# EAGLE design Stackduino-SMD (EAGLE 7.2.0)
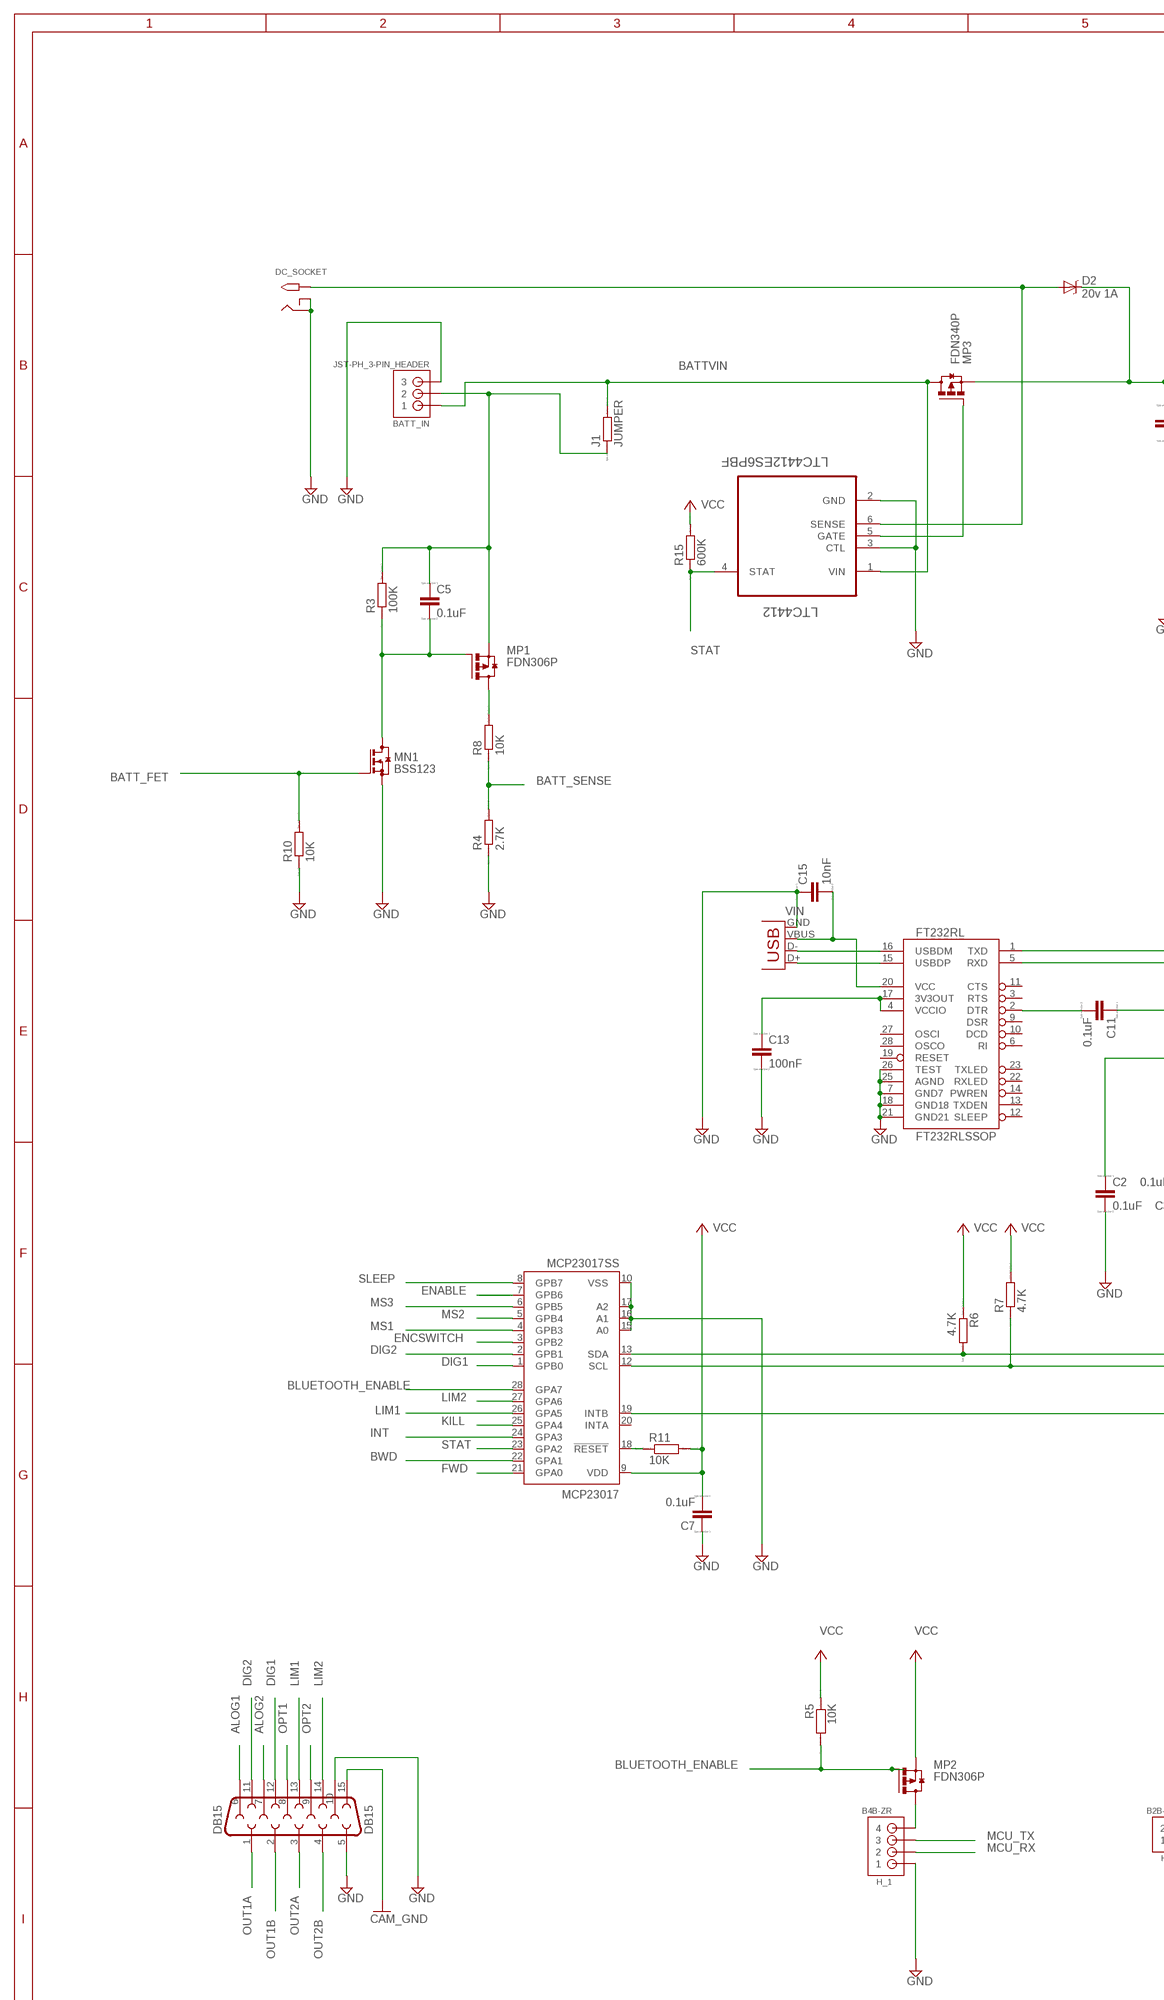
[diagram p0: schematic, sheet 1, part 1 of 2]
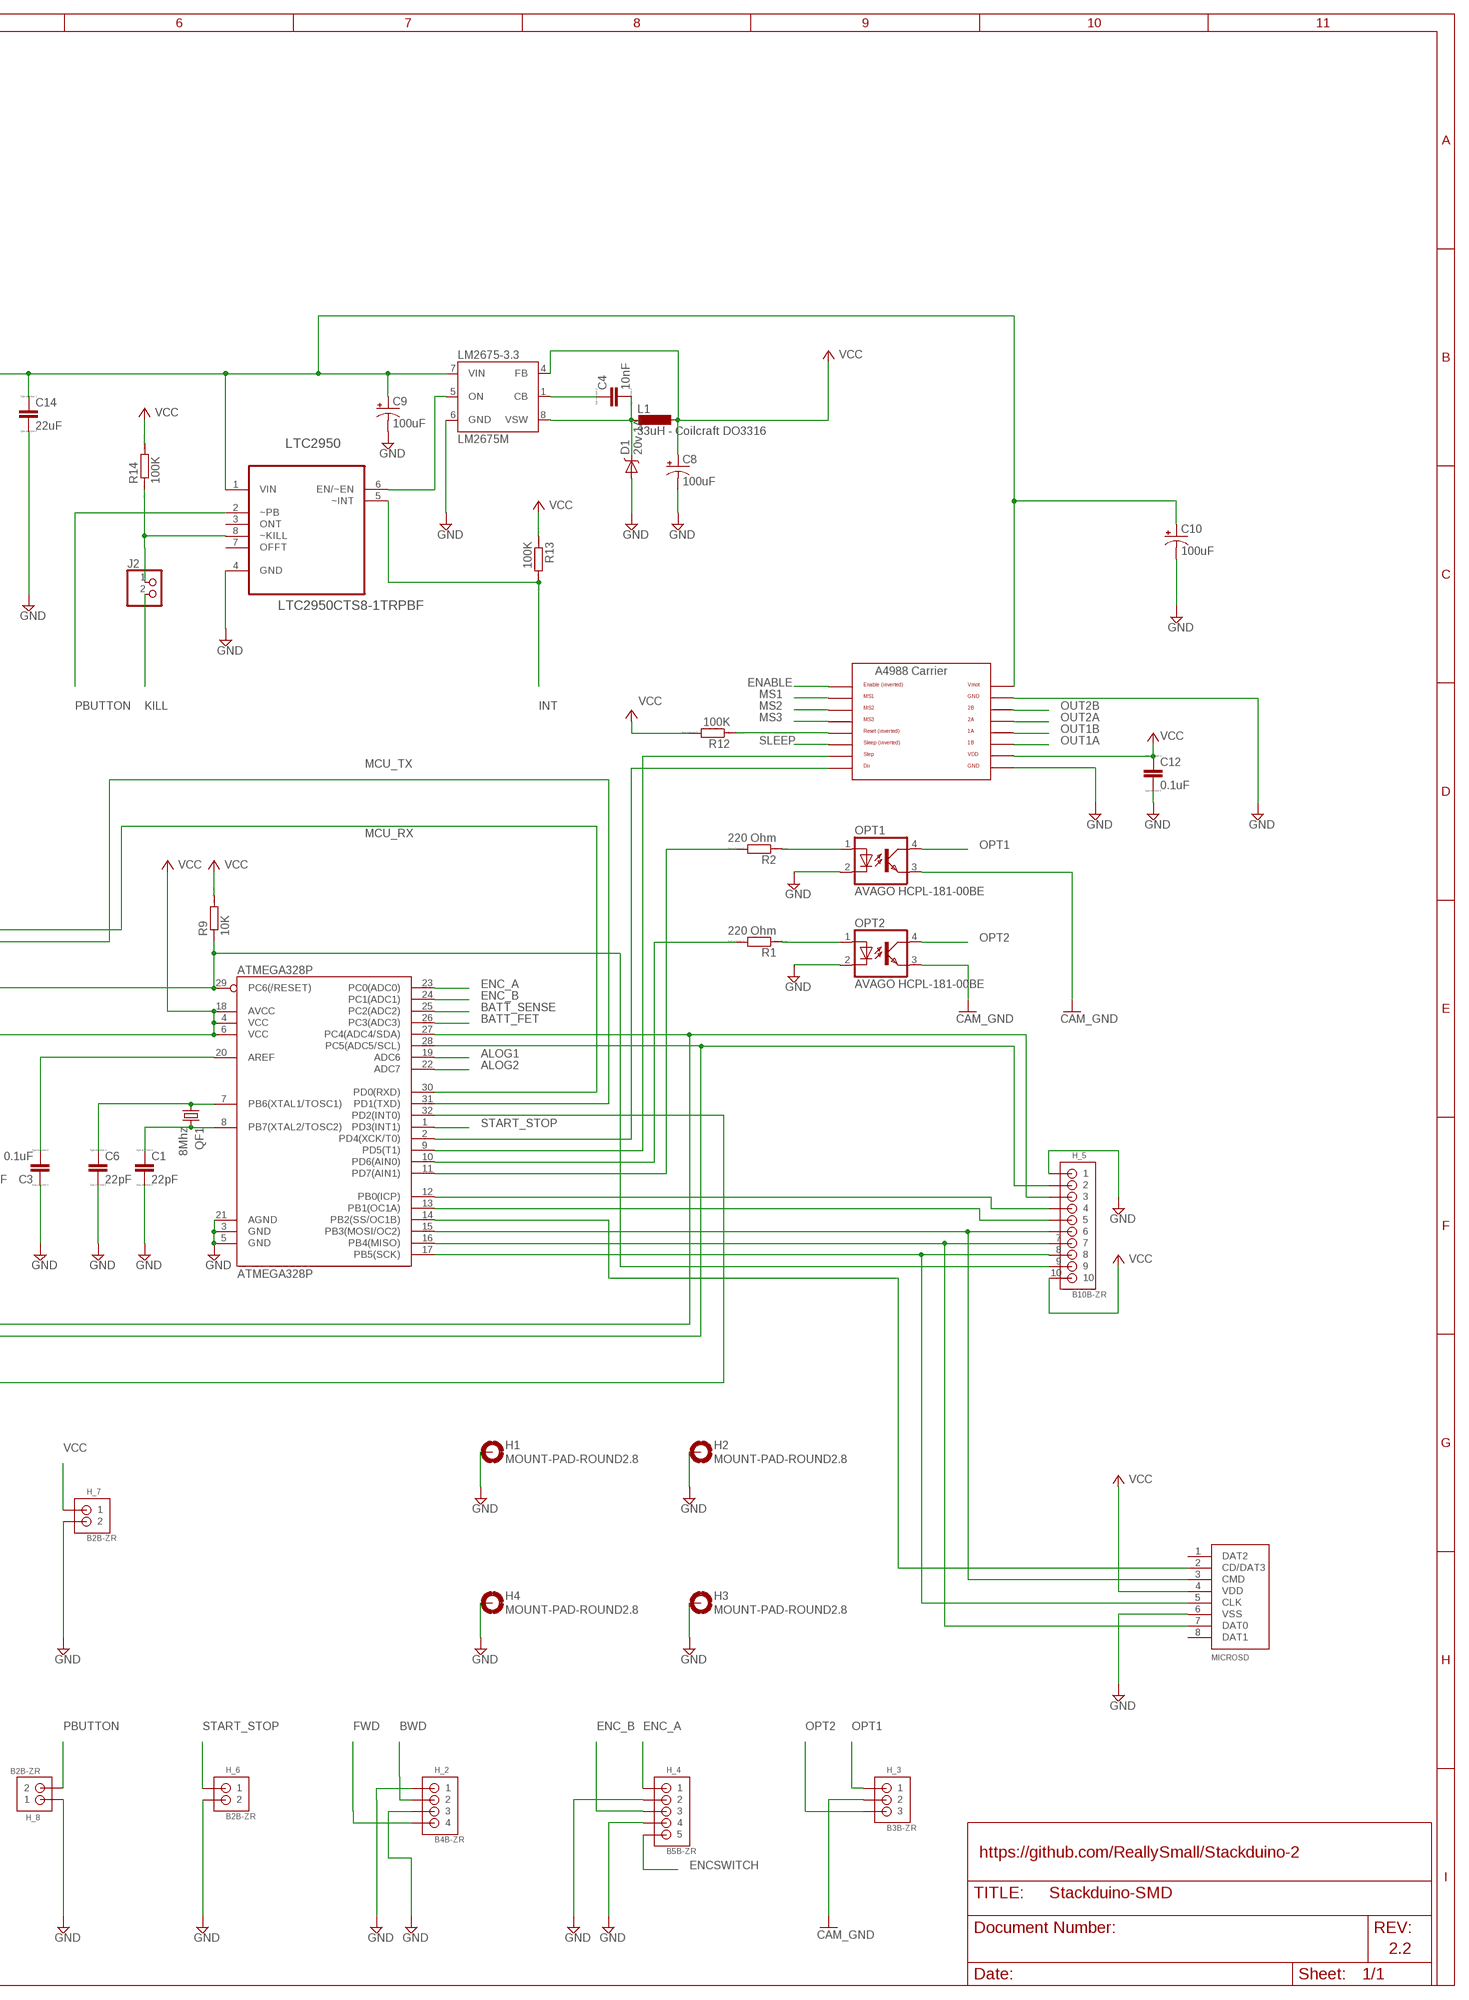
[diagram p1: schematic, sheet 1, part 2 of 2]

## Parts
A4988_CARRIER  A4988BREAKOUT  [A4988BREAKOUT]
ATMEGA328P  ATMEGA328P  ATMEGA328_SMT  [TQFP32-08]
BATT_IN  JST-PH_3-PIN_HEADER  [JST_B3B-PH_HEADER]
C1  22pF  C  [C0805]
C2  0.1uF  C  [C0805]
C3  0.1uF  C  [C0805]
C4  10nF  C  [C0805]
C5  0.1uF  C  [C0805]
C6  22pF  C  [C0805]
C7  0.1uF  C  [C0805]
C8  100uF  CAP_POLD  [PANASONIC_D]
C9  100uF  CAP_POLD  [PANASONIC_D]
C10  100uF  CAP_POLD  [PANASONIC_D]
C11  0.1uF  C  [C0805]
C12  0.1uF  C  [C0805]
C13  100nF  C  [C0805]
C14  22uF  C  [C0805]
C15  10nF  C  [C0805]
D1  20v 1A  MBRA140  [SMA-DIODE]
D2  20v 1A  MBRA140  [SMA-DIODE]
DB15  DB15  [DB15]
DC_SOCKET  2.1MMJACKTHM  [PJ-102A]
FT232RL  FT232RLSSOP  [SSOP28DB]
H1  MOUNT-PAD-ROUND2.8  [2,8-PAD]
H2  MOUNT-PAD-ROUND2.8  [2,8-PAD]
H3  MOUNT-PAD-ROUND2.8  [2,8-PAD]
H4  MOUNT-PAD-ROUND2.8  [2,8-PAD]
H_1  B4B-ZR  [B4B-ZR]
H_2  B4B-ZR  [B4B-ZR]
H_3  B3B-ZR  [B3B-ZR]
H_4  B5B-ZR  [B5B-ZR]
H_5  B10B-ZR  [B10B-ZR]
H_6  B2B-ZR  [B2B-ZR]
H_7  B2B-ZR  [B2B-ZR]
H_8  B2B-ZR  [B2B-ZR]
J1  JUMPER  R  [R0805]
J2  PINHD-1X2  [1X02]
L1  33uH - Coilcraft DO3316  DO3316P  [DO3316P]
LM2675-3.3  LM2675M  [SO08]
LTC2950  LTC2950CTS8-1TRPBF  [SOT65P280X100-8N]
LTC4412  LTC4412ES6PBF  [SOT95P280X100-6N]
MCP23017  MCP23017SS  [SSOP28]
MICROSD  CON_MICROSDHINGED  [CON_MICROSD_HINGED]
MN1  BSS123  [SOT23]
MP1  FDN306P  FDN360P  [SUPER-SOT3]
MP2  FDN306P  FDN360P  [SUPER-SOT3]
MP3  FDN340P  FDN360P  [SUPER-SOT3]
OPT1  AVAGO HCPL-181-00BE  LTV816S  [SMD4]
OPT2  AVAGO HCPL-181-00BE  LTV816S  [SMD4]
QF1  8Mhz  CRYSTALHC49U-V  [HC49U-V]
R1  220 Ohm  R  [R0805]
R2  220 Ohm  R  [R0805]
R3  100K  R  [R0805]
R4  2.7K  R  [R0805]
R5  10K  R  [R0805]
R6  4.7K  R  [R0805]
R7  4.7K  R  [R0805]
R8  10K  R  [R0805]
R9  10K  R  [R0805]
R10  10K  R  [R0805]
R11  10K  R  [R0805]
R12  100K  R  [R0805]
R13  100K  R  [R0805]
R14  100K  R  [R0805]
R15  600K  R  [R0805]
USB  USBSMD  [USB-MINIB]

## Nets
3V3_SET: C13.1 FT232RL.4(VCCIO) FT232RL.17(3V3OUT)
A4988_RESET: A4988_CARRIER.RST R12.1
ALOG1: ATMEGA328P.19(ADC6) DB15.6
ALOG2: ATMEGA328P.22(ADC7) DB15.7
BATT_FET: ATMEGA328P.26(PC3(ADC3)) MN1.1(G) R10.2
BATT_SENSE: ATMEGA328P.25(PC2(ADC2)) R4.2 R8.1
BATT_SENSE_UPSTREAM: MP1.3(D) R8.2
BATT_VOLT: BATT_IN.P2 C5.1 J1.1 MP1.2(S) R3.2
BATT_VOLT_ENABLE: C5.2 MN1.3(D) MP1.1(G) R3.1
BATTVIN: BATT_IN.P1 J1.2 LTC4412.1(VIN) MP3.3(D)
BLUETOOTH_ENABLE: MCP23017.28(GPA7) MP2.1(G) R5.2
BWD: H_2.2 MCP23017.22(GPA1)
CAM_GND: DB15.15 H_3.2 OPT1.3(EMIT) OPT2.3(EMIT)
DIG1: DB15.12 MCP23017.1(GPB0)
DIG2: DB15.11 MCP23017.2(GPB1)
DIR: A4988_CARRIER.DIR ATMEGA328P.2(PD4(XCK/T0))
ENABLE: A4988_CARRIER.EN MCP23017.7(GPB6)
ENC_A: ATMEGA328P.23(PC0(ADC0)) H_4.1
ENC_B: ATMEGA328P.24(PC1(ADC1)) H_4.3
ENCSWITCH: H_4.5 MCP23017.3(GPB2)
FWD: H_2.4 MCP23017.21(GPA0)
GATE: LTC4412.5(GATE) MP3.1(G)
GND: A4988_CARRIER.GND A4988_CARRIER.GND@0(GND) ATMEGA328P.3(GND) ATMEGA328P.5(GND) ATMEGA328P.21(AGND) BATT_IN.P3 C1.2 C2.2 C3.1 C6.2 C7.1 C8.- C9.- C10.- C12.2 C13.2 C14.2 C15.1 D1.A DB15.5 DB15.10 DC_SOCKET.RING DC_SOCKET.RING_SW FT232RL.7(GND7) FT232RL.18(GND18) FT232RL.21(GND21) FT232RL.25(AGND) FT232RL.26(TEST) H1.B2,8(MOUNT) H2.B2,8(MOUNT) H3.B2,8(MOUNT) H4.B2,8(MOUNT) H_1.1 H_2.1 H_2.3 H_4.2 H_4.4 H_5.1 H_6.2 H_7.2 H_8.1 LM2675-3.3.6(GND) LTC2950.4(GND) LTC4412.2(GND) LTC4412.3(CTL) MCP23017.10(VSS) MCP23017.15(A0) MCP23017.16(A1) MCP23017.17(A2) MICROSD.6(VSS) MN1.2(S) OPT1.2(C) OPT2.2(C) R4.1 R10.1 USB.GND
I2C_SCL: ATMEGA328P.28(PC5(ADC5/SCL)) H_5.2 MCP23017.12(SCL) R7.1
I2C_SDA: ATMEGA328P.27(PC4(ADC4/SDA)) H_5.3 MCP23017.13(SDA) R6.2
INT: LTC2950.5(~INT) MCP23017.24(GPA3) R13.2
KILL: J2.2 MCP23017.25(GPA4)
KILL_2: J2.1 LTC2950.8(~KILL) R14.1
LIM1: DB15.13 MCP23017.26(GPA5)
LIM2: DB15.14 MCP23017.27(GPA6)
LM2675_CB: C4.1 LM2675-3.3.1(CB)
LM2675_ENABLE: LM2675-3.3.5(ON) LTC2950.6(EN/~EN)
LM2675_OUT: C4.2 D1.C L1.1 LM2675-3.3.8(VSW)
MCP_INT: ATMEGA328P.32(PD2(INT0)) MCP23017.19(INTB)
MCP_RESET: MCP23017.18(!RESET) R11.1
MCU_RX: ATMEGA328P.30(PD0(RXD)) FT232RL.1(TXD) H_1.2
MCU_TX: ATMEGA328P.31(PD1(TXD)) FT232RL.5(RXD) H_1.3
MISO: ATMEGA328P.16(PB4(MISO)) H_5.7 MICROSD.7(DAT0)
MOSI: ATMEGA328P.15(PB3(MOSI/OC2)) H_5.6 MICROSD.3(CMD)
MS1: A4988_CARRIER.MS1 MCP23017.4(GPB3)
MS2: A4988_CARRIER.MS2 MCP23017.5(GPB4)
MS3: A4988_CARRIER.MS3 MCP23017.6(GPB5)
N$3: C11.2 FT232RL.2(DTR)
N$5: FT232RL.16(USBDM) USB.D-
N$6: FT232RL.15(USBDP) USB.D+
N$11: ATMEGA328P.20(AREF) C3.2
N$13: H_1.4 MP2.3(D)
N$30: C15.2 FT232RL.20(VCC) USB.VBUS
OPT1: DB15.8 H_3.1 OPT1.4(COL)
OPT1_IN: OPT1.1(A) R2.1
OPT1_MCU: ATMEGA328P.11(PD7(AIN1)) R2.2
OPT2: DB15.9 H_3.3 OPT2.4(COL)
OPT2_IN: OPT2.1(A) R1.1
OPT2_MCU: ATMEGA328P.10(PD6(AIN0)) R1.2
OUT1A: A4988_CARRIER.1B DB15.1
OUT1B: A4988_CARRIER.1A DB15.2
OUT2A: A4988_CARRIER.2A DB15.3
OUT2B: A4988_CARRIER.2B DB15.4
PBUTTON: H_8.2 LTC2950.2(~PB)
RESET: ATMEGA328P.29(PC6(/RESET)) C11.1 H_5.9 R9.1
SCK: ATMEGA328P.17(PB5(SCK)) H_5.8 MICROSD.5(CLK)
SLEEP: A4988_CARRIER.SLP(SLEEP) MCP23017.8(GPB7)
SS_1: ATMEGA328P.14(PB2(SS/OC1B)) MICROSD.2(CD/DAT3)
SS_2: ATMEGA328P.13(PB1(OC1A)) H_5.5
SS_3: ATMEGA328P.12(PB0(ICP)) H_5.4
START_STOP: ATMEGA328P.1(PD3(INT1)) H_6.1
STAT: LTC4412.4(STAT) MCP23017.23(GPA2) R15.1
STEP: A4988_CARRIER.STEP ATMEGA328P.9(PD5(T1))
V+: A4988_CARRIER.VMOT C9.+ C10.+ C14.1 D2.C LM2675-3.3.7(VIN) LTC2950.1(VIN) MP3.2(S)
VCC: A4988_CARRIER.VDD ATMEGA328P.4(VCC) ATMEGA328P.6(VCC) ATMEGA328P.18(AVCC) C2.1 C7.2 C8.+ C12.1 H_5.10 H_7.1 L1.2 LM2675-3.3.4(FB) MCP23017.9(VDD) MICROSD.4(VDD) MP2.2(S) R5.1 R6.1 R7.2 R9.2 R11.2 R12.2 R13.1 R14.2 R15.2
VIN: D2.A DC_SOCKET.TIP LTC4412.6(SENSE)
XTAL1: ATMEGA328P.7(PB6(XTAL1/TOSC1)) C6.1 QF1.1
XTAL2: ATMEGA328P.8(PB7(XTAL2/TOSC2)) C1.1 QF1.2
Unconnected: FT232RL.3(RTS) FT232RL.6(RI) FT232RL.9(DSR) FT232RL.10(DCD) FT232RL.11(CTS) FT232RL.12(SLEEP) FT232RL.13(TXDEN) FT232RL.14(PWREN) FT232RL.19(RESET) FT232RL.22(RXLED) FT232RL.23(TXLED) FT232RL.27(OSCI) FT232RL.28(OSCO) LTC2950.3(ONT) LTC2950.7(OFFT) MCP23017.20(INTA) MICROSD.1(DAT2) MICROSD.8(DAT1)

## Notes on the sheet
- https://github.com/ReallySmall/Stackduino-2
- 2.2

## Library data of the parts
A4988_CARRIER = RepRapjr:A4988BREAKOUT
ATMEGA328P = SparkFun-DigitalIC:ATMEGA328_SMT: 32-Pin Atmega328 part Commonly used on Arduino compatible boards Available in QFP and QFN packages TQFP is IC-09069 QFN is non-stock; PROD_ID: IC-09069
BATT_IN = SRG:JST-PH_3-PIN_HEADER: 3-pin JST PH Shrouded Header, top entry P/N B3B-PH-K-S Mating connector PHR-3
C1-C7 C11-C15 = eagle-ltspice:C: CAPACITOR, European symbol; SPICEMODEL: NONE; SPICEPREFIX: C
C8-C10 = SparkFun-Passives:CAP_POL: Capacitor Polarized These are standard SMD and PTH capacitors. Normally 10uF, 47uF, and 100uF in electrolytic and tantalum varieties. Always verify the external diameter of the through hole cap, it varies with capacity, voltage, and manufacturer. The EIA devices should be standard.
D1 D2 = SparkFun-DiscreteSemi:MBRA140: 40V, 1A Schottky rectifier SMA/DO-214AC package DIO-08053; PROD_ID: DIO-08053
DB15 = SparkFun-Connectors:DB15: DB15 / VGA right angle through-hole female connector.
DC_SOCKET = adafruit:2.1MMJACK: 2.1mm x 5.5mm THM DC jack with internal switch. Digikey part #PJ-102A, 4UCON part #05537 2.1mm x 5.5mm SMT DC jack with internal switch. Digikey part #PJ-002A-SMT, 4UCON part #03267 By microbuilder.eu & adafruit.com
FT232RL = SparkFun-DigitalIC:FT232RL: USB UART FT232RL 4th Generation USB UART (USB <-> Serial) Controller. Spark Fun Electronics SKU : COM-00650 Production SKU IC-00870; PROD_ID: IC-00870
H1-H4 = holes:MOUNT-PAD-ROUND: MOUNTING PAD, round
H_1 H_2 = jst-connectors:B4B-ZR: JST-ZH Connector 4 pol, 1.5mm pitch Package: B4B-ZR Source: http://www.jst-mfg.com/product/pdf/eng/eZH.pdf
H_3 = jst-connectors:B3B-ZR: JST-ZH Connector 3 pol, 1.5mm pitch Package: B3B-ZR Source: http://www.jst-mfg.com/product/pdf/eng/eZH.pdf
H_4 = jst-connectors:B5B-ZR: JST-ZH Connector 5 pol, 1.5mm pitch Package: B5B-ZR Source: http://www.jst-mfg.com/product/pdf/eng/eZH.pdf
H_5 = jst-connectors:B10B-ZR: JST-ZH Connector 9 pol, 1.5mm pitch Package: B9B-ZR
H_6-H_8 = jst-connectors:B2B-ZR: JST-ZH Connector 2 pol, 1.5mm pitch Package: B2B-ZR
J1 R1-R15 = eagle-ltspice:R: RESISTOR, European symbol; SPICEMODEL: NONE; SPICEPREFIX: R
J2 = pinhead:PINHD-1X2: PIN HEADER
L1 = inductor-coilcraft:DO3316P: COILCRAFT; OC_FARNELL: unknown; OC_NEWARK: unknown
LM2675-3.3 = v-reg-3:LM2675: National Semiconductor <http://www.national.com> 1.0A "Simple Switcher"(c) 260kHz, Vout 1.2-37V, Vin 40V, 250mOhm DMOS switch, 50µA standby current
LTC2950 = LTC_By_element14_Batch_1:LTC2950CTS8-1TRPBF: Push Button On/Off Controller; MPN: LTC2950CTS8-1#TRPBF; OC_FARNELL: 1537418; OC_NEWARK: 56M7180; PACKAGE: TSOT-23-8; SUPPLIER: Linear Technology
LTC4412 = LTC_By_element14_Batch_1:LTC4412ES6PBF: Low Loss PowerPath Controller; MPN: LTC4412ES6#PBF; OC_FARNELL: 1531480; OC_NEWARK: 61M3335; PACKAGE: TSOT-23-6; SUPPLIER: Linear Technology
MCP23017 = adafruit:MCP23017: http://ww1.microchip.com/downloads/en/DeviceDoc/21952a.pdf Source: http://ww1.microchip.com/downloads/en/DeviceDoc/21952a.pdf
MICROSD = dp_devices:CON_MICROSD
MN1 = transistor-small-signal:BSS123: N-CHANNEL MOS FET
MP1-MP3 = transistor-power:FDN360P: Single P-Channel, PowerTrench (R) MOSFET Source: http://www.fairchildsemi.com/ds/FD/FDN360P.pdf
OPT1 OPT2 = optocoupler:LTV816: OPTO COUPLER Source: LITEON, LTV816.pdf; OC_FARNELL: unknown; OC_NEWARK: unknown
QF1 = crystal:CRYSTAL: CRYSTAL; OC_FARNELL: 1666969; OC_NEWARK: unknown
USB = SparkFun-Connectors:USB: USB Connectors USB-B-PTH is fully proven SKU : PRT-00139/CONN-08278 USB-miniB is fully proven SKU : PRT-00587 USB-A-PCB is untested. USB-A-H is throughly reviewed, but untested. Spark Fun Electronics SKU : PRT-00437 USB-B-SMT is throughly reviewed, but untested. Needs silkscreen touching up. USB-A-S has not been used/tested USB-MB-H has not been used/tested USB-MICROB has been used. CONN-09505

## Board
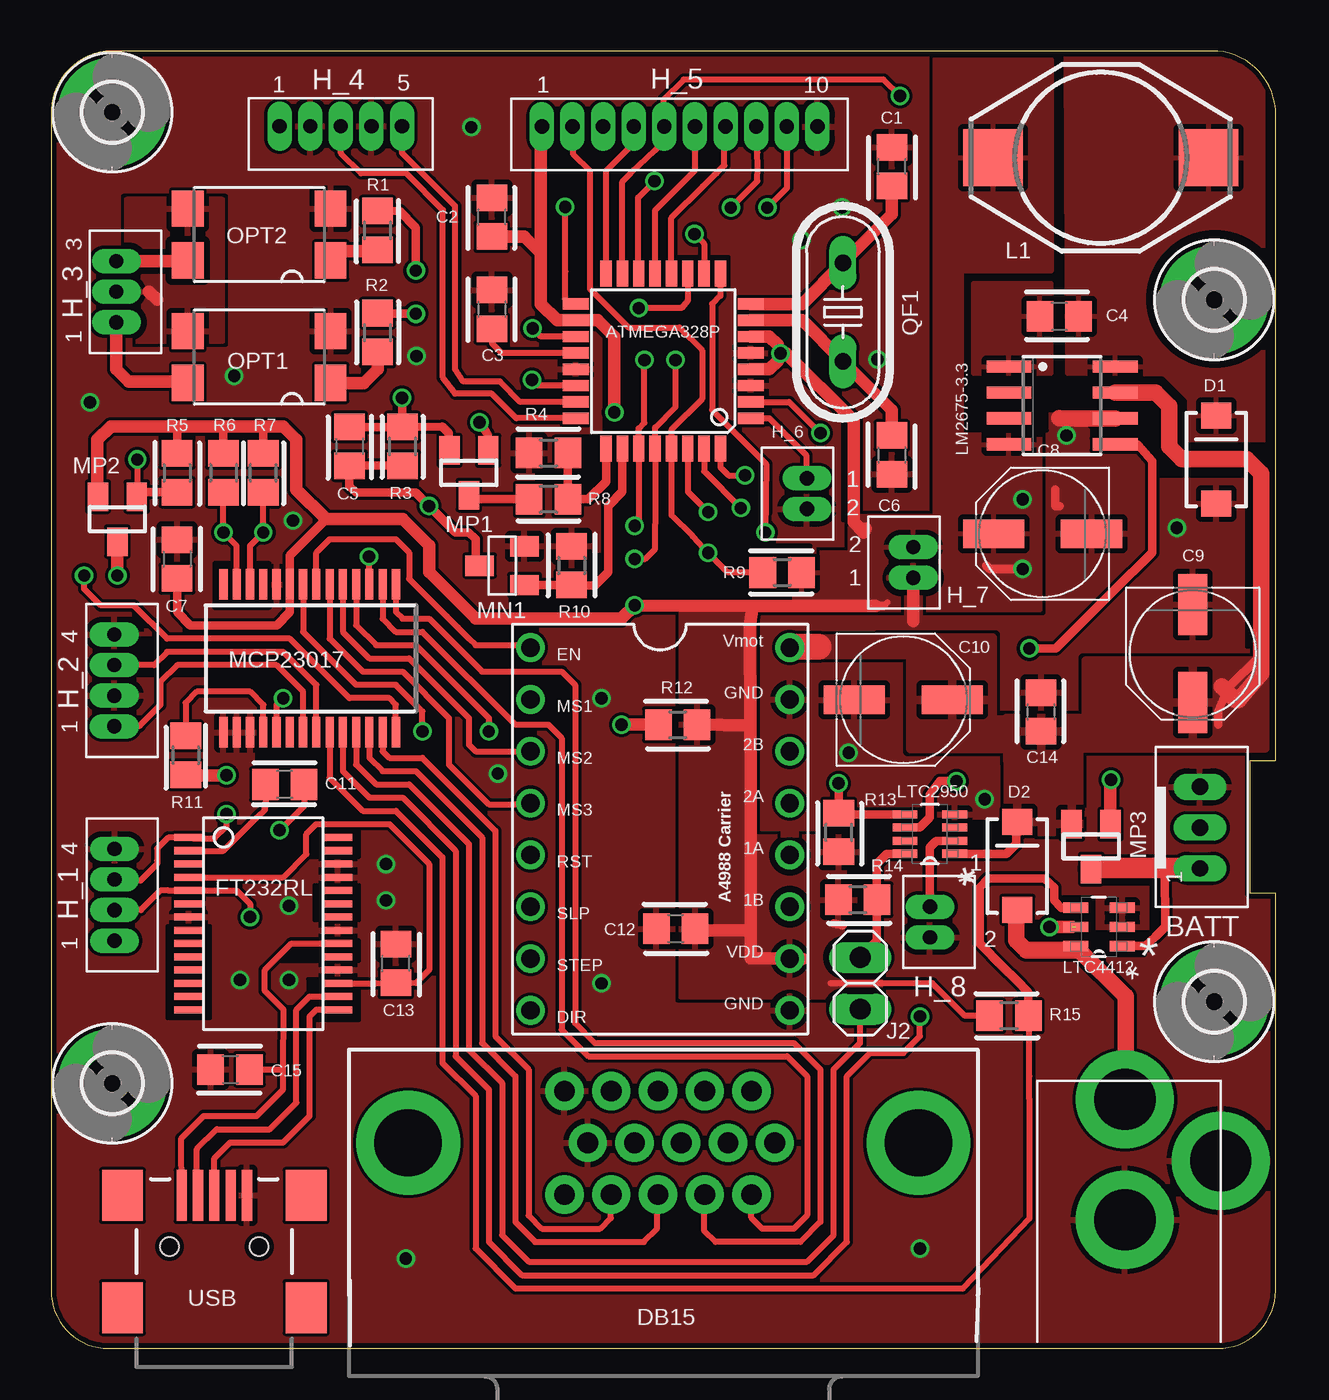
[diagram p2: board, top side]
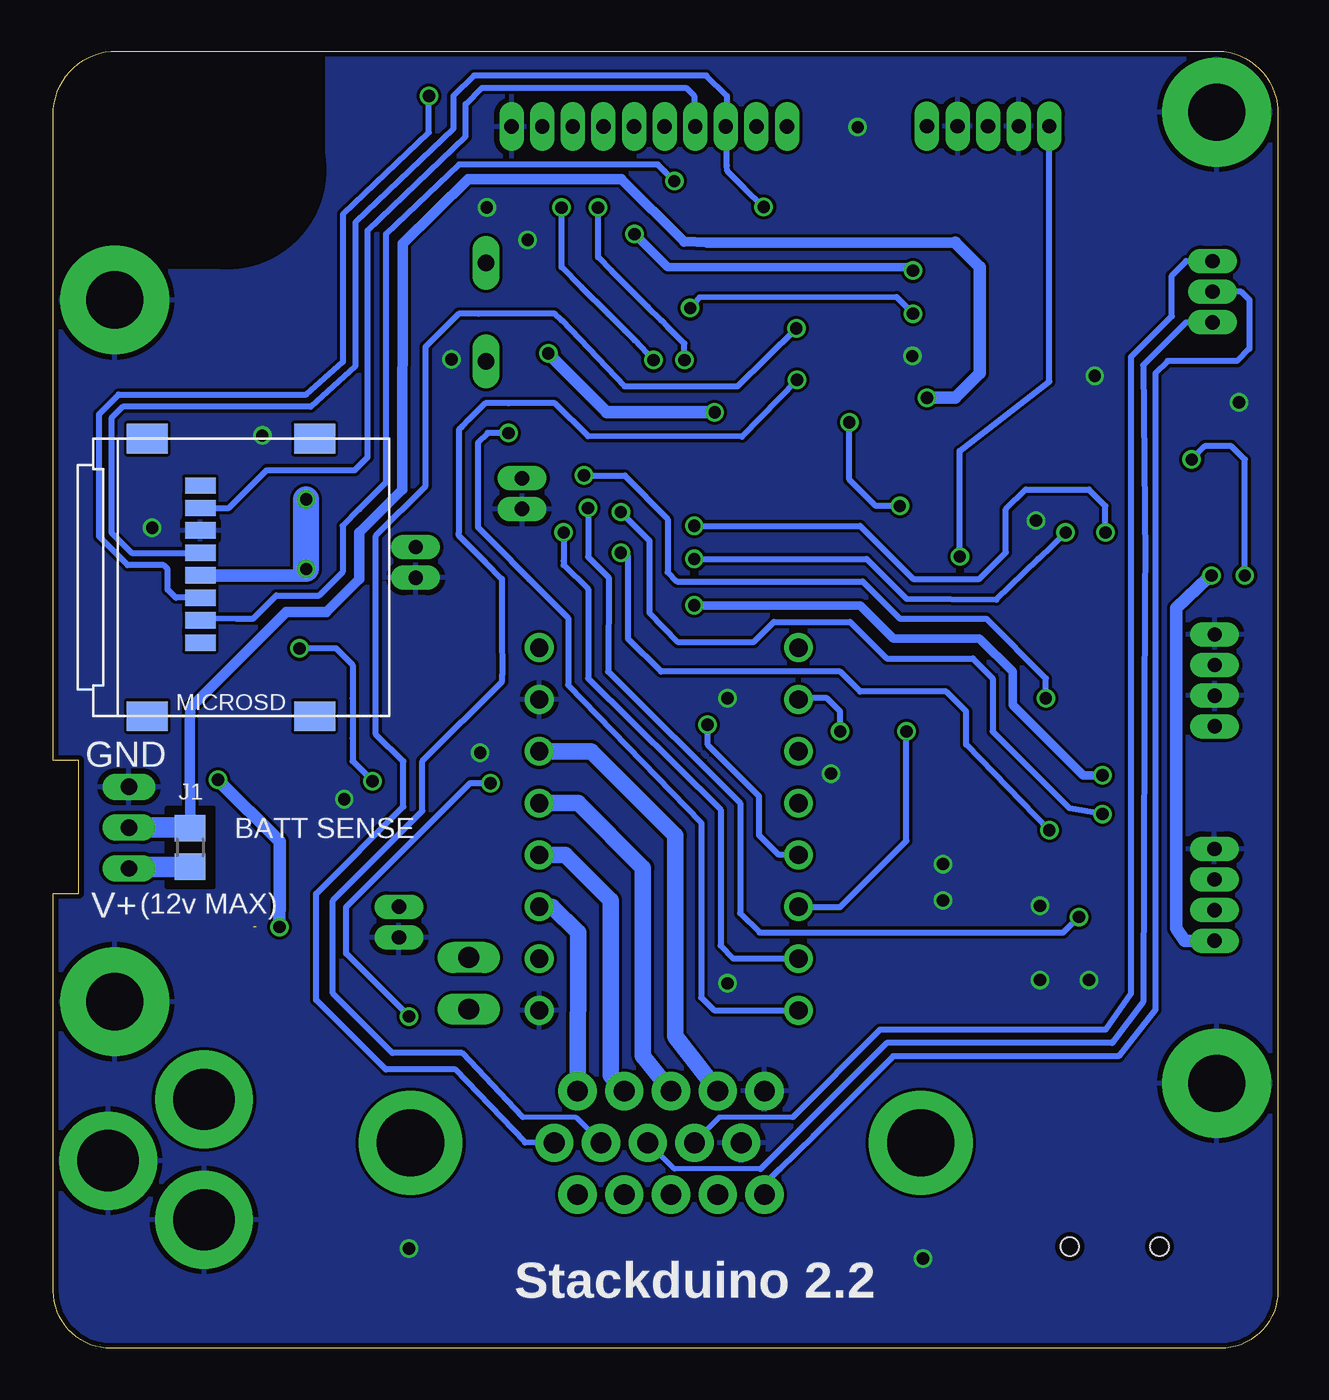
[diagram p3: board, bottom side, seen from below]

Size 60.01 x 63.6 mm. Coordinates in mm from the lower left corner, seen from the top.
Outline: 0,60.46 0,2.83 arc90 2.83,0 57.17,0 arc90 60,2.83 60,22.31 58.75,22.31 58.75,28.81 60,28.81 60,60.17 arc90 57.17,63.6 2.94,63.6 arc90 0,60.46
Copper layers (1*16): Top 0.035mm / dielectric 1.5mm / Bottom 0.035mm
Design rules "SeeedStudio_2layer_DRU_no_angle_20140221": minimum track width 6mil, minimum drill 12mil, track to track 6mil, track to pad 6mil, pad to pad 6mil, via to via 6mil, smd to smd 0mil, copper to edge 10mil, drill to drill 10mil, minimum pad ring 10mil, minimum via ring 6mil, stop-mask expansion 2mil, vias tented up to drill 100mil, thermal gap 10mil
tRestrict: area 10.1,27.6 to 14,29.8; area 7.6,32 to 12.3,35.5; area 3.9,33 to 7.6,34.8; area 30.4,41 to 35.3,43.2; area 30.6,40.5 to 35.1,41; area 30.9,40.2 to 35.3,40.5; area 31.4,39.8 to 34.9,40.2; area 31.5,39.5 to 35.3,39.8; area 35.1,38.2 to 35.4,40; area 34.9,38.7 to 37.2,39.4; area 46.4,45.2 to 48.2,47.4; area 48,45 to 48.8,47.6; 38 more areas
bRestrict: area 52.2,22.6 to 54.4,26.5; area 46.9,53.2 to 56.1,62.3; area 51.4,53 to 62.1,63.7; area 46.8,57.7 to 51,63.6

### Footprints (pad centres in the part's own frame; a part is rotated, then mirrored left to right if it is on the bottom)
A4988BREAKOUT = drill 0.9: 1A 8.89,1.27; 1B 11.43,1.27; 2A 6.35,1.27; 2B 3.81,1.27; DIR 16.51,-11.43; EN -1.27,-11.43; GND 16.51,1.27; GND@0 1.27,1.27; MS1 1.27,-11.43; MS2 3.81,-11.43; MS3 6.35,-11.43; RST 8.89,-11.43; SLP 11.43,-11.43; STEP 13.97,-11.43; VDD 13.97,1.27; VMOT -1.27,1.27
TQFP32-08 = smd 1.27 x 0.559: 1 -4.293,2.8; 2 -4.293,2; 3 -4.293,1.2; 4 -4.293,0.4; 5 -4.293,-0.4; 6 -4.293,-1.2; 7 -4.293,-2; 8 -4.293,-2.8; 17 4.293,-2.8; 18 4.293,-2; 19 4.293,-1.2; 20 4.293,-0.4; 21 4.293,0.4; 22 4.293,1.2; 23 4.293,2; 24 4.293,2.8 | smd 0.559 x 1.27: 9 -2.8,-4.293; 10 -2,-4.293; 11 -1.2,-4.293; 12 -0.4,-4.293; 13 0.4,-4.293; 14 1.2,-4.293; 15 2,-4.293; 16 2.8,-4.293; 25 2.8,4.293; 26 2,4.293; 27 1.2,4.293; 28 0.4,4.293; 29 -0.4,4.293; 30 -1.2,4.293; 31 -2,4.293; 32 -2.8,4.293
JST_B3B-PH_HEADER = drill 0.8 long: P1 2.027,0.048; P2 0.028,0.048; P3 -1.972,0.048
C0805 = smd 1.3 x 1.5: 1 -0.95,0; 2 0.95,0
PANASONIC_D = smd 3 x 1.4: + 2.4,0; - -2.4,0
SMA-DIODE = smd 1.27 x 1.47: A -2.15,0; C 2.15,0
DB15 = drill 1.016 pad 1.88: 1 -4.32,-7.62; 2 -2.03,-7.62; 3 0.26,-7.62; 4 2.55,-7.62; 5 4.84,-7.62; 6 -5.46,-5.08; 7 -3.17,-5.08; 8 -0.88,-5.08; 9 1.41,-5.08; 10 3.7,-5.08; 11 -4.32,-2.54; 12 -2.03,-2.54; 13 0.26,-2.54; 14 2.55,-2.54; 15 4.84,-2.54 | drill 3.302 pad 5.08: G1 -12.5,-5.08; G2 12.5,-5.08
PJ-102A = drill 3 pad 4.8: RING 0.1,-3.39; RING_SW -4.6,-6.29; TIP 0.1,-9.29
SSOP28DB = smd 0.348 x 1.397: 1 -4.225,-3.656; 2 -3.575,-3.656; 3 -2.925,-3.656; 4 -2.275,-3.656; 5 -1.625,-3.656; 6 -0.975,-3.656; 7 -0.325,-3.656; 8 0.325,-3.656; 9 0.975,-3.656; 10 1.625,-3.656; 11 2.275,-3.656; 12 2.925,-3.656; 13 3.575,-3.656; 14 4.225,-3.656; 15 4.225,3.656; 16 3.575,3.656; 17 2.925,3.656; 18 2.275,3.656; 19 1.625,3.656; 20 0.975,3.656; 21 0.325,3.656; 22 -0.325,3.656; 23 -0.975,3.656; 24 -1.625,3.656; 25 -2.275,3.656; 26 -2.925,3.656; 27 -3.575,3.656; 28 -4.225,3.656
2,8-PAD = drill 2.8 pad 5.334: B2,8 0,0
B4B-ZR = drill 0.7 long: 1 6,-1.3; 2 4.5,-1.3; 3 3,-1.3; 4 1.5,-1.3
B3B-ZR = drill 0.7 pad 1.1 long: 1 -1.5,0; 2 0,0; 3 1.5,0
B5B-ZR = drill 0.7 long: 1 3,0.013; 2 1.5,0.013; 3 0,0.013; 4 -1.5,0.013; 5 -3,0.013
B10B-ZR = drill 0.7 long: 1 6.751,-0.005; 2 5.251,-0.005; 3 3.751,-0.005; 4 2.251,-0.005; 5 0.751,-0.005; 6 -0.749,-0.005; 7 -2.249,-0.005; 8 -3.749,-0.005; 9 -5.249,-0.005; 10 -6.749,-0.005
B2B-ZR = drill 0.7 pad 1.1 long: 1 0.92,-0.75; 2 2.42,-0.75
R0805 = smd 1.3 x 1.5: 1 -0.95,0; 2 0.95,0
1X02 = drill 1.016 long: 1 -1.27,0; 2 1.27,0
DO3316P = smd 2.92 x 2.79: 1 -5.28,0; 2 5.28,0
SO08 = smd 0.6 x 2.2: 1 -1.905,-2.6; 2 -0.635,-2.6; 3 0.635,-2.6; 4 1.905,-2.6; 5 1.905,2.6; 6 0.635,2.6; 7 -0.635,2.6; 8 -1.905,2.6
SOT65P280X100-8N = smd 1.219 x 0.406: 1 -1.219,0.965; 2 -1.219,0.33; 3 -1.219,-0.33; 4 -1.219,-0.965; 5 1.219,-0.965; 6 1.219,-0.33; 7 1.219,0.33; 8 1.219,0.965
SOT95P280X100-6N = smd 1.219 x 0.508: 1 -1.143,0.94; 2 -1.143,0; 3 -1.143,-0.94; 4 1.143,-0.94; 5 1.143,0; 6 1.143,0.94
SSOP28 = smd 0.4 x 1.5: 1 -4.225,-3.625; 2 -3.575,-3.625; 3 -2.925,-3.625; 4 -2.275,-3.625; 5 -1.625,-3.625; 6 -0.975,-3.625; 7 -0.325,-3.625; 8 0.325,-3.625; 9 0.975,-3.625; 10 1.625,-3.625; 11 2.275,-3.625; 12 2.925,-3.625; 13 3.575,-3.625; 14 4.225,-3.625; 15 4.225,3.625; 16 3.575,3.625; 17 2.925,3.625; 18 2.275,3.625; 19 1.625,3.625; 20 0.975,3.625; 21 0.325,3.625; 22 -0.325,3.625; 23 -0.975,3.625; 24 -1.625,3.625; 25 -2.275,3.625; 26 -2.925,3.625; 27 -3.575,3.625; 28 -4.225,3.625
CON_MICROSD_HINGED = smd 0.8 x 1.5: 1 -3.2,2.6; 2 -2.1,2.6; 3 -1,2.6; 4 0.1,2.6; 5 1.2,2.6; 6 2.3,2.6; 7 3.4,2.6; 8 4.5,2.6 | smd 1.45 x 2: BODY@1 -6.8,5.2; BODY@2 -6.8,-3; BODY@3 6.8,-3; BODY@4 6.8,5.2
SOT23 = smd 1 x 1.4: 1 -0.95,-1.1; 2 0.95,-1.1; 3 0,1.1
SUPER-SOT3 = smd 1 x 1.4: 1 -0.95,-1.1; 2 0.95,-1.1; 3 0,1.1
SMD4 = smd 1.78 x 1.55: 1 -1.27,-3.5; 2 1.27,-3.5; 3 1.27,3.5; 4 -1.27,3.5
HC49U-V = drill 0.813 long: 1 -2.413,0; 2 2.413,0
USB-MINIB = smd 2.5 x 0.5: D+ 2.5,0; D- 2.5,0.8; GND 2.5,-1.6; ID 2.5,-0.8; VBUS 2.5,1.6 | smd 2.5 x 2: MTN1 -3,4.5; MTN2 2.5,4.5; MTN3 -3,-4.5; MTN4 2.5,-4.5 | hole 0.9: 0,2.2; 0,-2.2

### Placement (x,y rotation side)
A4988_CARRIER  34.92,33.09 270 top
ATMEGA328P  30,48.4 180 top
BATT_IN  56.25,25.56 270 top
C1  41.2,57.92 90 top
C2  21.6,55.45 90 top
C3  21.6,50.94 270 top
C4  49.4,50.6 0 top
C5  14.62,44.23 270 top
C6  41.2,43.8 270 top
C7  6.17,38.7 270 top
C8  48.59,39.94 180 top
C9  55.95,34.06 270 top
C10  41.76,31.8 0 top
C11  11.45,27.65 180 top
C12  30.61,20.58 180 top
C13  16.9,18.88 90 top
C14  48.51,31.2 90 top
C15  8.78,13.68 0 top
D1  57.1,43.58 90 top
D2  47.35,23.65 90 top
DB15  30,5 180 top
DC_SOCKET  52.72,2.92 180 top
FT232RL  10.4,20.83 270 top
H1  3,60.6 180 top
H2  57,51.4 180 top
H3  57,17 180 top
H4  3,13 180 top
H_1  1.81,18.49 90 top
H_2  1.8,29 90 top
H_3  3.2,51.8 90 top
H_4  14.2,59.9 0 top
H_5  30.8,59.9 0 top
H_6  37.79,43.58 270 top
H_7  43,40.2 270 top
H_8  42.32,19.24 90 top
J1  53.3,24.56 270 bottom
J2  39.65,17.9 270 top
L1  51.44,58.36 180 top
LM2675-3.3  49.54,46.22 270 top
LTC2950  43.06,25.21 180 top
LTC4412  51.35,20.66 180 top
MCP23017  12.68,33.83 180 top
MICROSD  50.2,37.8 90 bottom
MN1  22.1,38.38 90 top
MP1  20.48,42.92 180 top
MP2  3.25,40.65 180 top
MP3  50.96,24.6 180 top
OPT1  10.2,48.6 90 top
OPT2  10.2,54.6 90 top
QF1  38.8,50.8 90 top
R1  16,54.8 90 top
R2  16,49.8 90 top
R3  17.23,44.23 90 top
R4  24.38,43.9 0 top
R5  6.17,42.92 270 top
R6  8.45,42.92 270 top
R7  10.4,42.92 90 top
R8  24.38,41.62 180 top
R9  35.83,38.04 0 top
R10  25.51,38.38 270 top
R11  6.6,29.08 270 top
R12  30.71,30.58 0 top
R13  38.6,25.3 90 top
R14  39.52,22 180 top
R15  46.94,16.31 180 top
USB  8,5 90 top

### Tracks (layer width: path | path; a pad name or v marks a point on that pad's centre or on a via)
3V3_SET
  Top 0.305: FT232RL.17 15.93,17.9 C13.1 17.88,17.9 18.52,18.55 18.52,23.75 16.57,25.7 13,25.7 12.51,25.21 12.51,24.24 11.38,23.1 FT232RL.4
A4988_RESET  (via drill 0.6)
  Top 0.61: R12.1 30.02,30.53 29.98,30.58 v27.95,30.58
  Bottom 0.305: A4988_CARRIER.RST 24.45,24.2 25.41,25.16 25.41,27.06 27.62,29.27 27.93,29.58 v27.95,30.58
ALOG1  (via drill 0.6)
  Top 0.305: ATMEGA328P.19 24,49.6 v23.6,50
  Bottom 0.305: DB15.6 36.89,10.1 40.3,13.68 43.71,13.68 47.12,17.09 47.12,22.29 42.85,26.56 42.85,28.77 44.2,30.09 44.2,39.84 41.76,42.27 41.76,49.1 40.14,50.73 39.16,50.73 35.42,50.73 35.1,50.4 32.01,47.15 26.49,47.15 v23.6,50
ALOG2  (via drill 0.6)
  Top 0.305: ATMEGA328P.22 23.8,47.2 v23.56,47.48
  Bottom 0.254: 33.48,10.43 34.38,11.33 36.99,11.34
  Bottom 0.305: DB15.7 33.19,10.1 33.48,10.43 | 36.99,11.34 39.98,14.49 43.39,14.49 46.31,17.41 46.31,21.96 41.92,26.35 41.92,28.79 38.01,32.7 38.01,33.02 38.02,35.12 38.02,36.42 38.02,37.56 38.02,37.73 38.84,38.54 40.14,39.84 40.14,40 40.14,40.65 40.14,45.04 39.98,45.2 39.65,45.52 39.64,45.54 38.84,46.34 37.7,46.34 35.42,46.34 33.8,44.71 26.25,44.69 v23.56,47.48
BATT_FET
  Top 0.406: ATMEGA328P.26 28,42 27.3,41.3 27.3,38.05 26.65,37.4 25.35,37.4 R10.2 MN1.1
BATT_SENSE
  Top 0.406: R4.2 R8.1 26.32,41.62 27.2,42.48 ATMEGA328P.25
BATT_SENSE_UPSTREAM
  Top 0.406: R8.2 20.48,41.62 MP1.3
BATT_VOLT  (via drill 0.6)
  Top 0.406: v17.2,46.6 17.2,45.8 R3.2 | C5.1 R3.2 | R3.2 19.18,45.2 19.5,44.88 MP1.2
  Bottom 0.501: 46.64,36.1 45.01,37.73 | 42.9,42.11 44.85,40.16 45.01,40 | 27.96,54.2 29.1,54.25 32.17,57.33
  Bottom 0.511: 15.8,54.2 27.96,54.2 | 32.17,57.33 39.66,57.33 42.88,54.16 42.9,42.11 | 45.01,40 45.01,39.35 45.01,37.73 | 46.64,36.1 48.59,36.1 51.67,33.01 53.3,31.39 53.33,30.39 53.33,27.52 53.3,27.52 J1.1
  Bottom 0.61: v17.2,46.6 15.8,46.6 14.6,47.8 14.6,53 15.8,54.2
  Bottom 1.016: BATT_IN.P2 53.3,25.53 J1.1
BATT_VOLT_ENABLE  (via drill 0.6)
  Top 0.406: R3.1 C5.2 14.62,42.27 14.95,41.95 17.88,41.95 v18.52,41.3 19.82,40 20.48,40 20.8,39.67 20.8,38.58 MN1.3 | v21,45.4 21.4,44.8 21.43,44.55 MP1.1
  Bottom 0.305: v18.52,41.3 19.7,41.3 21,42.6 v21,45.4
BATTVIN
  Top 0.406: LTC4412.1 53.62,19.72 54.11,20.17 54.6,20.66 54.58,23.55
  Top 1.016: BATT_IN.P1 56.3,23.55 54.58,23.55 50.96,23.55 MP3.3
  Bottom 1.016: J1.2 56.3,23.61 BATT_IN.P1
BLUETOOTH_ENABLE  (via drill 0.6)
  Top 0.305: MCP23017.28 16.9,31.55 16.57,31.88 14.62,31.88 11.7,34.8 5.69,34.8 4.06,36.42 2.44,36.42 1.62,37.24 v1.62,37.89 | v4.22,43.58 4.22,41.45 MP2.1
  Top 0.406: R5.2 4.53,41.98 MP2.1
  Bottom 0.305: v1.62,37.89 1.62,43.58 2.27,44.23 3.58,44.23 v4.22,43.58
BWD
  Top 0.305: MCP23017.22 13,32.52 11.38,34.15 5.69,34.15 5.04,33.5 H_2.2
CAM_GND
  Top 0.61: 4.8,51.8 5.2,51.4 | 6.77,49.8 OPT1.3
  Bottom 0.305: DB15.15 24.93,8.3 24.4,8.8 22.75,10.43 18.85,14.32 7.8,14.32 6,16.6 6,47.8 5.4,48.4 2,48.4 1.4,49 1.4,51.4 1.8,51.8 H_3.2
  pour Top (isolate 0.305): 3.7,49.4 8.4,49.4 8.4,56.3 3.7,56.3
DIG1
  Top 0.305: MCP23017.1 16.9,36.1 17.23,35.77 18.52,35.77 21.12,33.17 25.02,33.17 25.68,32.52 25.68,15.95 26.65,14.98 36.4,14.98 37.7,13.68 37.7,6.2 36.73,5.23 32.57,5.23 32,5.78 DB15.12
DIG2
  Top 0.305: MCP23017.2 16.25,35.77 16.9,35.12 18.2,35.12 22.75,30.58 24.38,30.58 25.02,29.92 25.02,15.62 26.32,14.32 36.08,14.32 37.05,13.35 37.05,6.52 36.4,5.88 34.85,5.88 34.32,6.41 DB15.11
DIR  (via drill 0.6)
  Top 0.305: ATMEGA328P.2 36.17,46.4 v37.7,44.88
  Bottom 0.305: v37.7,44.88 38.73,44.88 39.2,44.4 39.2,40.26 38.44,39.5 36.69,37.71 34.77,35.8 34.77,32.52 28.26,25.78 28.26,17.21 27.62,16.57 A4988_CARRIER.DIR
ENABLE
  Top 0.305: MCP23017.7 13,39.02 13.65,39.67 16.9,39.67 17.55,39.02 17.55,37.73 18.85,36.42 arc-2 20.48,34.8 20.8,34.48 23.07,34.48 A4988_CARRIER.EN
ENC_A
  Top 0.305: ATMEGA328P.23 23,46.4 22,47.4 20.2,47.4 19.8,48 19.8,56 18.6,57.2 17.6,58.2 17.2,58.6 H_4.1
ENC_B
  Top 0.305: ATMEGA328P.24 22.8,45.6 21.6,46.8 19.8,46.8 19.2,47.6 19.2,55.8 17.4,57.6 15.2,57.6 14.2,58.6 H_4.3
ENCSWITCH  (via drill 0.6)
  Top 0.305: MCP23017.3 v15.59,38.82
  Bottom 0.305: v15.59,38.82 15.6,44 11.2,47.4 H_4.5
FWD
  Top 0.305: MCP23017.21 12.35,32.2 11.05,33.5 6.17,33.5 5.36,32.69 5.36,31.55 4.39,30.58 4.31,30.5 H_2.4
GATE  (via drill 0.6)  (1 unrouted)
  Top 0.61: 50.05,20.66 v48.92,20.66 | v51.94,27.88 51.91,27.74 MP3.1
  Bottom 0.61: v48.92,20.66 48.91,22.12 48.91,22.77 48.91,24.85 v51.94,27.88
GND  (via drill 0.6)
  Top 0.406: 49.2,42.1 49.2,41.3 49.42,41.3
  Top 0.61: H_7.2 42.25,35.65
  Top 0.813: LM2675-3.3.6 50.21,45.59 49.4,45.6
  other vias: 11.86,40.58 26.98,31.88 42.58,4.9 55.16,40.23 16.41,23.75 21.89,28.18 49.76,44.75 1.91,46.38 20.59,59.87 39.09,29.2 8.97,47.67 11.66,21.7 17.39,4.41 9.26,18.06 36.76,54.34 40.5,48.49 17.91,48.65 26.98,17.9 16.41,21.96 38.76,55.94 11.66,18.06 45.75,26.92
  pour Top (isolate 0.1, rank 2): -1.23,64.42 56,64.03 arc-90 61.23,62.67 62.23,8.09 arc-90 56.99,-1.74 3.55,-1.47 arc-90 -1.06,4.28
  pour Bottom (isolate 0.1): 60.09,64.29 60.74,1.14 arc-90 57.23,-0.9 1.57,-0.9 arc-90 -1.23,10.5 -1.55,64.55
I2C_SCL  (via drill 0.6)
  Top 0.305: MCP23017.12 9.75,39.35 v10.4,40 R7.1 | v28.6,38.7 29.11,38.7 29.6,39.19 29.6,40.4 ATMEGA328P.28 29.6,45.15 30.6,46.16 30.6,47.7 v30.6,48.45 | v35.1,55.92 36.08,56.9 36.08,58.85 36,59.22 H_5.2
  Bottom 0.305: v10.4,40 11.75,38.7 13.8,36.7 18.2,36.75 20.15,38.7 v28.6,38.7 | v30.6,48.45 31.52,49.42 32.01,49.91 32.83,50.73 34.12,52.03 35.1,53 35.1,53.49 v35.1,55.92
I2C_SDA  (via drill 0.6)
  Top 0.305: MCP23017.13 9.1,39.35 v8.45,40 R6.2 | v28.6,40.33 28.8,40.55 ATMEGA328P.27 28.8,45.1 29.07,45.38 v29.07,48.45 | v33.31,55.92 34.61,57.22 arc3 34.6,59.35 H_5.3
  Bottom 0.305: v8.45,40 8.45,41.3 9.26,42.11 12.35,42.11 13.32,41.14 13.32,39.02 14.62,37.73 17.88,37.73 20.48,40.33 v28.6,40.33 | v29.07,48.45 29.09,49.26 29.9,50.08 30.23,50.4 30.88,51.05 31.69,51.86 32.66,52.84 33.31,53.49 33.31,54.62 v33.31,55.92
INT  (via drill 0.6)
  Top 0.305: MCP23017.24 14.3,28.3 15.6,27 17.23,27 19.82,24.4 19.82,14.32 21.45,12.7 21.45,5.23 23.07,3.6 37.38,3.6 39,5.23 39,13.35 40.14,14.49 41.76,14.49 42.58,15.3 v42.58,16.27
  Top 0.406: 39.16,26.19 R13.2 | LTC2950.5 38.87,26.18 R13.2 | R13.2 38.59,26.25 v38.59,27.71
  Bottom 0.305: v42.58,16.27 45.66,19.36 45.66,21.64 40.7,26.6 39.59,27.71 v38.59,27.71
KILL
  Top 0.305: MCP23017.25 14.95,28.62 15.93,27.65 17.55,27.65 20.48,24.73 20.48,14.65 22.1,13.02 22.1,5.55 23.4,4.25 37.05,4.25 38.35,5.55 38.35,13.68 39.65,14.98 39.65,15.65 J2.2
KILL_2
  Top 0.406: LTC2950.8 40.96,24.25 40.46,23.75 40.46,22.01 | 40.46,22.01 R14.1 | 40.46,22.01 40.46,19.98 J2.1
LIM1
  Top 0.305: MCP23017.26 15.6,28.95 16.25,28.3 17.88,28.3 21.12,25.05 21.12,14.98 22.75,13.35 22.75,6.2 23.73,5.23 29.05,5.23 29.7,5.88 29.72,7.3 DB15.13
LIM2
  Top 0.305: MCP23017.27 16.25,29.27 16.57,28.95 18.2,28.95 21.77,25.38 21.77,15.3 23.4,13.68 23.4,6.52 24.05,5.88 26.9,5.88 27.43,6.4 27.43,7.18 DB15.14
LM2675_CB
  pour Top: 49,47.8 49,52.2 45.2,52.2 45.2,47.8
LM2675_ENABLE  (via drill 0.6)
  Top 0.406: LTC2950.6 42.25,25.54 42.58,25.54 43.06,26.02 43.06,27.16 43.55,27.81 v44.36,27.81 | v47.94,34.31 49.24,34.31 51.19,36.26 52,37.08 53.95,39.02 53.95,43.09 53.95,43.5 53.24,44.31 LM2675-3.3.5
  Bottom 0.305: v47.94,34.31 46.15,34.31 45.34,33.5 45.34,31.88 45.34,29.92 45.34,28.79 v44.36,27.81
LM2675_OUT
  pour Top: 49.8,47.8 53.2,47.8 53.2,44.4 59.4,44.4 59.4,63.4 49.73,63.4
MCP_INT  (via drill 0.6)
  Top 0.305: ATMEGA328P.32 32.8,43.2 33.2,42.8 v34,42.8 | MCP23017.19 11.05,31.55 v11.38,31.88
  Bottom 0.305: v11.38,31.88 11.38,32.85 14.3,35.77 18.52,35.77 20.35,37.6 29.45,37.6 29.9,38.05 29.9,40.65 32,42.8 v34,42.8
MCP_RESET
  Top 0.305: MCP23017.18 10.4,31.55 9.75,32.2 7.15,32.2 6.6,31.65 R11.1
MCU_RX  (via drill 0.6)
  Top 0.305: ATMEGA328P.30 31.2,42 v32.2,41 | v8.6,26.2 8.6,25.6 8,25 7,25 FT232RL.1 5.75,25.05 5.2,24.5 5.2,23.91 5.2,23.75 4.39,22.94 3.74,22.94 3.69,22.99 H_1.2
  Bottom 0.305: v8.6,26.2 10.2,26.48 13.97,30.25 13.97,32.85 14.95,33.83 19.18,33.83 20.96,35.61 24.7,35.61 25.68,34.64 29.41,34.64 30.8,36.08 30.8,39.6 v32.2,41
MCU_TX  (via drill 0.6)
  Top 0.305: v9.75,21.15 9.75,21.8 9.1,22.45 FT232RL.5 5.75,22.45 5.36,22.45 4.4,21.49 H_1.3 | ATMEGA328P.31 32,43 v33.8,41.2
  Bottom 0.305: v33.8,41.2 33.8,38.8 32.8,37.8 32.83,33.17 26.35,26.73 26.35,21.34 25.4,20.38 12.38,20.38 10.52,20.39 v9.75,21.15
MISO
  Top 0.305: ATMEGA328P.16 27.2,57.72 28.6,59.12 28.6,59.4 H_5.7
  Bottom 0.305: MICROSD.7 51.4,41.2 49.55,43.05 45.24,43.05 44.6,43.69 44.6,54.8 39.8,59.4 39.8,61 39,61.8 29,61.8 28.6,61.4 28.6,60.2 H_5.7
MOSI  (via drill 0.6)
  Top 0.305: ATMEGA328P.15 28,57.2 28.4,57.6 29.6,58.74 30,59.14 30,59.42 H_5.6 30,60.2 30,61.2 31,62.2 40.8,62.2 v41.6,61.4
  Bottom 0.305: MICROSD.3 54,36.8 54.4,37.2 54.4,38.2 54.6,38.4 56.36,38.4 57.76,39.8 57.76,45.8 56.8,46.76 47.6,46.76 45.8,48.36 45.8,55.6 41.6,59.6 v41.6,61.4
MS1  (via drill 0.6)
  Top 0.305: MCP23017.4 14.95,35.45 15.93,34.48 17.88,34.48 21.45,30.9 v21.45,30.25
  Bottom 0.305: v21.45,30.25 21.45,31.23 22.1,31.88 23.4,31.88 A4988_CARRIER.MS1
MS2
  Top 0.305: MCP23017.5 14.3,35.12 15.6,33.83 17.55,33.83 20.48,30.9 20.48,29.6 20.8,29.27 A4988_CARRIER.MS2
MS3
  Top 0.305: MCP23017.6 13.65,34.8 15.28,33.17 17.23,33.17 19.5,30.9 19.5,28.62 21.45,26.67 22.75,26.67 A4988_CARRIER.MS3
N$3
  Top 0.305: FT232RL.2 8.45,24.4 10.07,26.02 10.47,26.4 10.57,27.02 C11.2
N$5
  Top 0.305: USB.D- 7.15,8.48 7.15,9.77 8.12,10.75 10.72,10.75 12.03,12.05 12.03,16.6 12.68,17.25 FT232RL.16
N$6
  Top 0.305: USB.D+ 8.01,9.33 8.78,10.1 11.38,10.1 12.68,11.4 12.68,16.27 13,16.6 FT232RL.15
N$11
  Top 0.305: ATMEGA328P.20 22.2,48.8 22.07,48.8 21.61,49.26 C3.2
N$13  (via drill 0.6)
  Top 0.61: v3.25,37.89 MP2.3
  Bottom 0.61: v3.25,37.89 3.45,37.76 4.97,36.29 4.97,20.59 4.58,19.99 H_1.4
N$30
  Top 0.305: USB.VBUS 6.39,10.3 7.47,11.4 10.07,11.4 11.38,12.7 11.38,13.68 | 11.38,13.68 11.4,16.6 10.47,17.52 10.47,18.55 11.78,19.85 FT232RL.20 | C15.2 11.38,13.68
OPT1
  Top 0.305: 6.63,47.4 OPT1.4
  Top 0.61: H_3.1 3.2,48 3.8,47.4 6.63,47.4
  Bottom 0.254: 25.35,8.8 29.57,8.8 DB15.8
  Bottom 0.305: 25.35,8.8 19.18,14.98 8.12,14.98 6.6,17 6.53,37.33 6.5,38.7 6.6,48.2 4.5,50.3 H_3.1
OPT1_IN
  Top 0.61: R2.1 16,48 15.33,47.33 OPT1.1
OPT1_MCU  (via drill 0.6)
  Top 0.305: ATMEGA328P.11 31.2,51.38 30.9,51 v28.8,51
  Top 0.406: v17.88,50.73 16.57,50.73 R2.2
  Bottom 0.305: v17.88,50.73 18.69,51.54 28.34,51.51 v28.8,51
OPT2
  Top 0.305: 6.7,53.3 OPT2.4
  Top 0.61: H_3.3 6.7,53.3
  Bottom 0.254: 23.78,11.33 27.38,11.33 DB15.9
  Bottom 0.305: 23.78,11.33 19.5,15.62 8.45,15.62 7.2,17.4 7.2,48.6 5.2,50.6 5.2,52.6 4.5,53.3 H_3.3
OPT2_IN
  Top 0.305: R1.1 15.95,53.8 | 14,53.8 13.7,53.5 OPT2.1
  Top 0.61: 15.95,53.8 14,53.8
OPT2_MCU  (via drill 0.6)
  Top 0.305: v31.52,54.62 32,54.15 ATMEGA328P.10
  Top 0.406: R1.2 17.06,55.76 17.88,54.95 v17.88,52.84
  Bottom 0.406: v17.88,52.84 17.8,53 29.9,53 30.88,53.97 v31.52,54.62
OUT1A
  Bottom 0.813: DB15.1 34.29,20.38 35.56,21.66 A4988_CARRIER.1B
OUT1B
  Bottom 0.813: DB15.2 32.7,13.4 32.7,21.97 34.92,24.2 A4988_CARRIER.1A
OUT2A
  Bottom 0.813: DB15.3 31.11,14.35 31.11,23.56 34.29,26.73 A4988_CARRIER.2A
OUT2B
  Bottom 0.813: DB15.4 29.53,15.3 29.53,25.15 33.66,29.27 A4988_CARRIER.2B
PBUTTON
  Top 0.406: LTC2950.2 43.38,24.88 43.06,24.56 43.06,23.1 H_8.2
RESET  (via drill 0.6)
  Top 0.152: 30.48,43.88 ATMEGA328P.29
  Top 0.305: C11.1 12.4,26.6 v11.2,25.4 | H_5.9 25.6,59.4 25.6,58.53 26.4,57.72 26.4,52 26.4,51.95 28.3,50.05 30.79,50.05 31.9,48.94 31.9,46.54 30.4,45.04 ATMEGA328P.29 30.4,40.85 31.44,39.81 v32.2,39 33.16,38.04 R9.1
  Bottom 0.305: v11.2,25.4 15.28,29.6 15.28,31.23 16.25,32.2 20.48,32.2 21.45,33.17 30.23,33.17 31.85,34.8 31.85,38.83 v32.2,39
SCK  (via drill 0.6)
  Top 0.305: v25.2,55.96 25.2,52.8 25.2,51.4 25.6,51.2 ATMEGA328P.17
  Bottom 0.305: v25.2,55.96 26.16,56.9 26.98,57.71 27,58 27,59.84 H_5.8 27,59.95 27,61.4 28,62.4 39.4,62.4 40.4,61.4 40.4,59.8 45.2,55.2 45.2,48.16 47.4,46.16 56.6,46.16 57.16,45.6 57.16,40 56.16,39 MICROSD.5
SLEEP  (via drill 0.6)
  Top 0.305: v18.2,30.25 18.2,31.23 16.9,32.52 14.95,32.52 12.35,35.12 MCP23017.8
  Bottom 0.305: A4988_CARRIER.SLP 23.24,21.64 21.45,21.64 18.2,24.89 v18.2,30.25
SS_1  (via drill 0.6)
  Top 0.305: ATMEGA328P.14 28.76,53.16 28.76,56.41 v29.57,57.22
  Bottom 0.305: v29.57,57.22 30.06,57.71 30.39,58.04 40.14,58.04 43.71,54.62 43.71,42.44 45.01,41.14 45.83,40.33 45.83,38.05 46.96,36.91 49.08,36.91 50.21,35.77 51.02,35.77 52.6,35.8 MICROSD.2
SS_2
  Top 0.305: ATMEGA328P.13 29.6,55.79 31.56,57.75 31.56,59.35 H_5.5
SS_3
  Top 0.305: ATMEGA328P.12 30.4,55.42 31.93,56.95 32.6,57.6 33,58 33,59 32.99,59.01 H_5.4
START_STOP
  Top 0.305: ATMEGA328P.1 35.2,45.6 35.6,45.2 37,43.8 37,43.2 37,42.8 H_6.1
STAT
  Top 0.305: MCP23017.23 13.65,27.98 15.28,26.35 16.9,26.35 19.18,24.08 19.18,14 20.8,12.38 20.8,4.9 22.75,2.95 44.69,2.95 47.94,6.36 47.94,11.73 47.94,12.21 47.94,13.35 47.94,16.26 R15.1
  Top 0.406: LTC4412.4 49.51,21.6 49.15,21.96 49.15,22.61 48.66,23.05 47.14,23.04 45.92,23.04 45.5,22.61 45.5,20.01 45.5,19.85 46.64,18.71 47.29,18.06 47.89,17.46 R15.1
STEP  (via drill 0.6)
  Top 0.305: ATMEGA328P.9 32.8,52.66 32.8,51.6 32.4,51.2 32.4,46 33.8,44.6 35.04,43.36 v35,40
  Bottom 0.305: A4988_CARRIER.STEP 26.68,19.11 27.31,19.75 27.31,26.42 33.8,32.85 33.8,37.23 35,38.4 35,38.6 v35,40
V+
  Top 0.406: 57.2,30.58 57.2,31.26 57.69,32.39 | 57.69,32.39 57.38,32.44 57.2,32.47 | 52,46.8 LM2675-3.3.7 | 59.2,33.91 57.69,32.39 | 47.45,25.38 D2.C | LTC2950.1 45.19,24.25 46.81,24.25 47.29,24.73 47.29,25.74 D2.C | 47.28,25.86 D2.C
  Top 0.813: LM2675-3.3.7 54.14,46.86 54.8,46.2 54.8,44.2 55.4,43.6 58.6,43.6 59.3,42.88 59.3,33.09 58.2,31.8 58.02,31.8 57.38,32.44
  Top 1.27: 36.2,34.4 37.6,34.4
  pour Top: 57.83,30.84 52.98,30.25 53.51,30.04 58.5,29.92
  pour Top (isolate 0.305): 56.31,33.73 59.52,33.74 59.5,29.4 52.3,29.4 50.2,29.39 49.8,25.55 46.96,25.71 46.8,30.9 50.7,30.9 50.7,33.73
  pour Top (isolate 0.305): 46.88,29.5 50.38,29.5 50.38,25.33 46.88,25.33
  pour Top (isolate 0.305): 47.31,30.84 47.34,29.38 42.1,29.38 42.1,34 36,34 36,34.8 40.59,34.8 40.62,34.85 46.15,34.85 46.15,30.84
VCC  (via drill 0.6)
  Top 0.305: R11.2 6.83,28.1 | 40.99,36.59 40.8,36.39 | R15.2 44.77,16.31 43.19,17.9 38.19,17.9
  Top 0.406: C7.2 6.17,36.1 6.83,35.45 11.05,35.45 11.7,36.1 MCP23017.9 11.7,38.88 13.47,40.65 | R6.1 8.45,45.2 | R7.2 10.4,45.2 | 40.8,36.39 40.4,36.4 | 38.35,20.83 38.8,20.75 | R5.1 6.15,43.55 6.17,43.9 6.17,45.2 | v47.61,38.21 45.99,38.21 45.83,38.38
  Top 0.61: 34.29,19.11 A4988_CARRIER.VDD 36.8,19.11 | 34.29,19.11 34.29,20.5 31.56,20.5 C12.1 | ATMEGA328P.6 35.2,49.6 35.6,49.2 v35.75,48.77 | v35.75,48.77 35.6,48.4 35.2,48 ATMEGA328P.4 | v35.75,48.77 36,48.8 39.33,45.48 39.33,40.5 39.83,40 39.92,40.2 | v27.6,45.89 27.6,49.6 26.8,50.4 ATMEGA328P.18 24.8,50.4 24,51.2 24,53.69 | 40.4,36.4 34.39,36.4 | 34.39,36.4 v28.6,36.42 27.95,35.77 20.8,35.77 18.52,38.05 18.52,39.35 17.23,40.65 13.47,40.65 12.03,42.1 12.03,44.55 11.38,45.2 10.4,45.2 8.45,45.2 6.17,45.2 2.92,45.2 2.27,44.55 2.27,41.62 MP2.2 | 34.29,19.11 34.29,26.04 34.28,27.97 34.26,30.58 | 34.26,30.58 34.23,35.44 34.39,36.4 | 6.83,28.1 v8.6,28.1 | 24,53.69 24,59.22 H_5.10 | 24,53.69 23.19,54.5 C2.1 | R12.2 34.22,30.53 34.26,30.58
  Bottom 0.406: v8.6,28.1 9.55,28.1 13,31.55 13,33.17 14.62,34.8 18.85,34.8 20.48,36.42 v28.6,36.42 | 47.76,37.9 v47.61,38.21
  Bottom 0.61: v35.75,48.77 32.89,45.89 v27.6,45.89 | MICROSD.4 47.76,37.9
  Bottom 1.27: v47.61,38.21 v47.61,41.62
  pour Top (isolate 0.305): 49,52.8 44.6,52.8 44.6,44.8 48.45,44.8 48.45,36.2 36.44,36.2 36.44,39.01 39.16,39.01 39.16,40.81 43.33,40.8 43.33,63.2 49,63.2
  pour Top (isolate 0.305): 30.88,36.42 30.88,17.25 40.62,17.25 40.62,25.05 34.45,25.05 34.45,36.42
VIN
  Top 0.406: LTC4412.6 47.32,19.72 arc90 47.29,20.01
  Top 0.813: DC_SOCKET.TIP 52.65,12.38 52.65,17.25 50.38,19.52 47.77,19.52 47.29,20.01 47.29,20.63 47.29,21.31 D2.A
XTAL1
  Top 0.61: ATMEGA328P.7 36.8,50.4 QF1.1 41.2,46 C6.1
XTAL2
  Top 0.305: QF1.2
  Top 0.61: ATMEGA328P.8 36.8,51.2 QF1.2 | QF1.2 41.2,55.6 C1.1

### Text on the board
tPlace: A4988 Carrier
bPlace: Stackduino 2.2
bNames: GND | BATT SENSE | (12v MAX) | V+
tDocu: o
tSilk: * | *
_tsilk: 1 | 5 | 1 | 10 | 3 | 1 | 1 | 2 | 2 | 1 | 4 | 1 | 4 | 1 | 1 | 2 | BATT